# Altium schematic sheet MQ-135.SchDoc
size A4; SheetNumber: 11; SheetTotal: 11
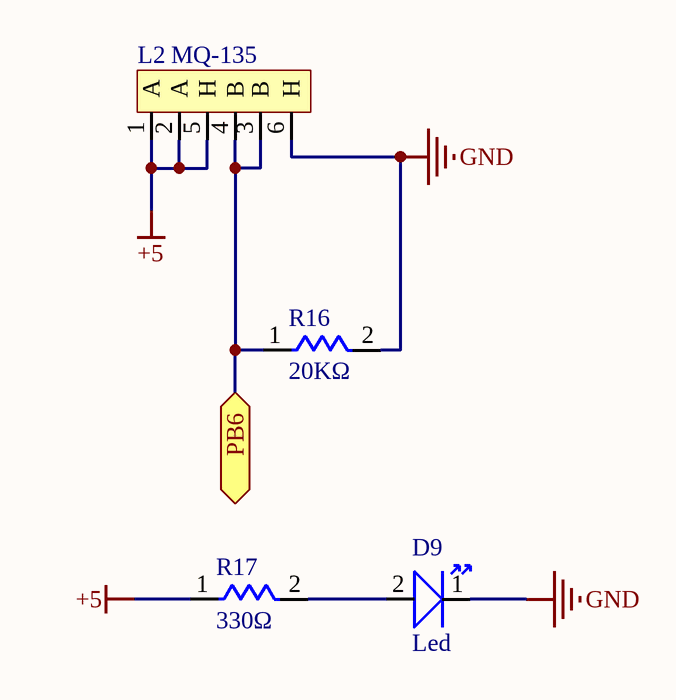
[diagram p0: MQ-135.SchDoc]

## Parts
D9  Led  [LED - 0603]
L2  MQ-135  [MQ-135]
R16  20KΩ  [RES - 0603]
R17  330Ω  [RES - 0603]

## Ports
PB6 (bidir)

## Nets
+5: L2.1(A) L2.2(A) L2.5(H) R17.1
GND: D9.1 L2.6(H) R16.2
PB6: L2.3(B) L2.4(B) R16.1 ; port PB6
NetD9_2: D9.2 R17.2

## Library data of the parts
D9 = Led: HL-PST-1608U51GC - LED SMD 0603 GREEN 500mcd 120° WATER CLEAR; ComponentLink1Description: Satın Alma Linki; ComponentLink1URL: https://ozdisan.com/Product/Detail/471660/HL-PST-1608U51GC; ComponentLink2Description: Datasheet; ComponentLink2URL: https://cdn.ozdisan.com/ETicaret_Dosya/471660_7204356.pdf
R16 R17 = Res: SMD Res; ComponentLink1Description: Datasheet; ComponentLink1URL: https://cdn.ozdisan.com/ETicaret_Dosya/570122_9878629.pdf; ComponentLink2Description: Satın Alma Linki; ComponentLink2URL: https://www.ozdisan.com/pasif-komponentler/direncler/smt-smd-direncler/TC0325B3301T5C; ComponentLink3Description: Satın Alma Linki; ComponentLink3URL: https://ozdisan.com/pasif-komponentler/direncler/smt-smd-ve-cip-direncler/0603SAF4701T5E; ComponentLink4Description: Satın Alma Linki; ComponentLink4URL: https://ozdisan.com/pasif-komponentler/direncler/smt-smd-ve-cip-direncler/0805S8F604JT5E; ComponentLink5Description: Satın Alma Linki; ComponentLink5URL: https://ozdisan.com/pasif-komponentler/direncler/smt-smd-ve-cip-direncler/0603SAF1022T5E; ComponentLink6Description: Satın Alma Linki; ComponentLink6URL: https://www.ozdisan.com/pasif-komponentler/direncler/smt-smd-direncler/CQ03SAF0000T5E
L2 = MQ-135: ComponentLink1Description: Satın Alma Linki; ComponentLink1URL: https://www.robotistan.com/hava-kalite-sensoru-mq-135; ComponentLink2Description: Datasheet; ComponentLink2URL: https://www.olimex.com/Products/Components/Sensors/Gas/SNS-MQ135/resources/SNS-MQ135.pdf